# Altium schematic sheet VTTVREF.SchDoc
size A4; SheetNumber: 4; SheetTotal: 5
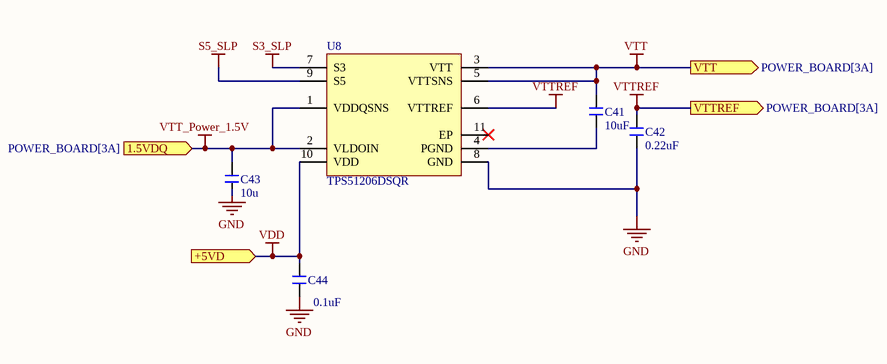
[diagram p0: VTTVREF.SchDoc]

## Parts
C41  10uF  [C 0805_L]
C42  0.22uF  [C 0805_L]
C43  10u  [C 0805_L]
C44  0.1uF  [C 0805_L]
U8  TPS51206DSQR  [DSQ0010A_V]

## Ports
1.5VDQ (in, see POWER_BOARD[3A]), +5VD (in, see POWER_BOARD[3A], 1VD, 1.5VD, 1.8VD, 3.3VD, 3.3VA[1B], 5VD_and_5VDC_and_12V[3B]), VTT (out, see POWER_BOARD[3A]), VTTREF (out, see POWER_BOARD[3A])

## Nets
GND: C42.1 C43.1 C44.1 U8.8(GND)
S3_SLP: U8.7(S3)
S5_SLP: U8.9(S5)
VDD: C44.2 U8.10(VDD) ; port +5VD
VTT: C41.2 U8.3(VTT) U8.5(VTTSNS) ; port VTT
VTT_Power_1.5V: C43.2 U8.1(VDDQSNS) U8.2(VLDOIN) ; port 1.5VDQ
VTTREF: C42.2 U8.6(VTTREF) ; port VTTREF
NetC41_1: C41.1 U8.4(PGND)

Not connected (* = marked no-connect by the designer): U8 11(EP)*

## Library data of the parts
C41 = C: 贴片电容 10 µF, 6.3 V, X5R, 1608 (0603),  JMK107BJ106MA; BOM名称: 无极性贴片电容; 淘宝ID: 封装库来自淘宝 ID：黄晶宝石; 联系售后，技术支持: https://shop463601444.taobao.com; 唯一出售店铺网址: https://shop463601444.taobao.com
C42 = C: 贴片电容 C4 0.22 µF, 6.3 V, X5R, 1005 (0402) Taiyo Yuden JMK105BJ224KV; BOM名称: 无极性贴片电容; 淘宝ID: 封装库来自淘宝 ID：黄晶宝石; 联系售后，技术支持: https://shop463601444.taobao.com; 唯一出售店铺网址: https://shop463601444.taobao.com
C43 = C: 贴片电容 10 µF, 6.3 V, X5R, 1608 (0603) Taiyo Yuden JMK107BJ106MA; BOM名称: 无极性贴片电容; 淘宝ID: 封装库来自淘宝 ID：黄晶宝石; 联系售后，技术支持: https://shop463601444.taobao.com; 唯一出售店铺网址: https://shop463601444.taobao.com
C44 = C: 贴片电容 0.1 µF, 6.3 V, X5R, 1005 (0402) Taiyo Yuden JWK105BJ104MP; BOM名称: 无极性贴片电容; 淘宝ID: 封装库来自淘宝 ID：黄晶宝石; 联系售后，技术支持: https://shop463601444.taobao.com; 唯一出售店铺网址: https://shop463601444.taobao.com
U8 = CMP-0395-00678-2: Single Output LDO, 2 A, with VTTREF Buffered Reference for DDR2, DDR3, DDR3L, 10-pin SON (DSQ), -40 to 85 degC, Green (RoHS & no Sb/Br); Manufacturer: Texas Instruments; SubFamily: Single Channel LDO; Iout(Max)(A): 2; Rating: Catalog; ComponentLink2Description: Datasheet; ComponentLink1URL: http://www.ti.com/; ComponentLink4URL: Samples URL:http://www.ti.com/product/tps51206#samples; PackageVersion: 4209243/B; Mounting Technology: Surface Mount; PackageReference: DSQ0010A; Eco-Plan: Green (RoHS & no Sb/Br); PackageDescription: 10-Pin Plastic Small Outline, Body 2 X 2 mm, Pitch 0.4 mm; ComponentLink4Description: URL Link1; DatasheetVersion: SLUSAH1; ComponentLink3URL: http://www.ti.com/litv/pdf/mpdi002c; ComponentLink2URL: http://www.ti.com/general/docs/lit/getliterature.tsp?genericPartNumber=TPS51206&fileType=pdf; PartNumber: TPS51206DSQR; ComponentLink3Description: Package Specification; ComponentLink1Description: Manufacturer URL